# EAGLE design Interface board (EAGLE 9.3.0)
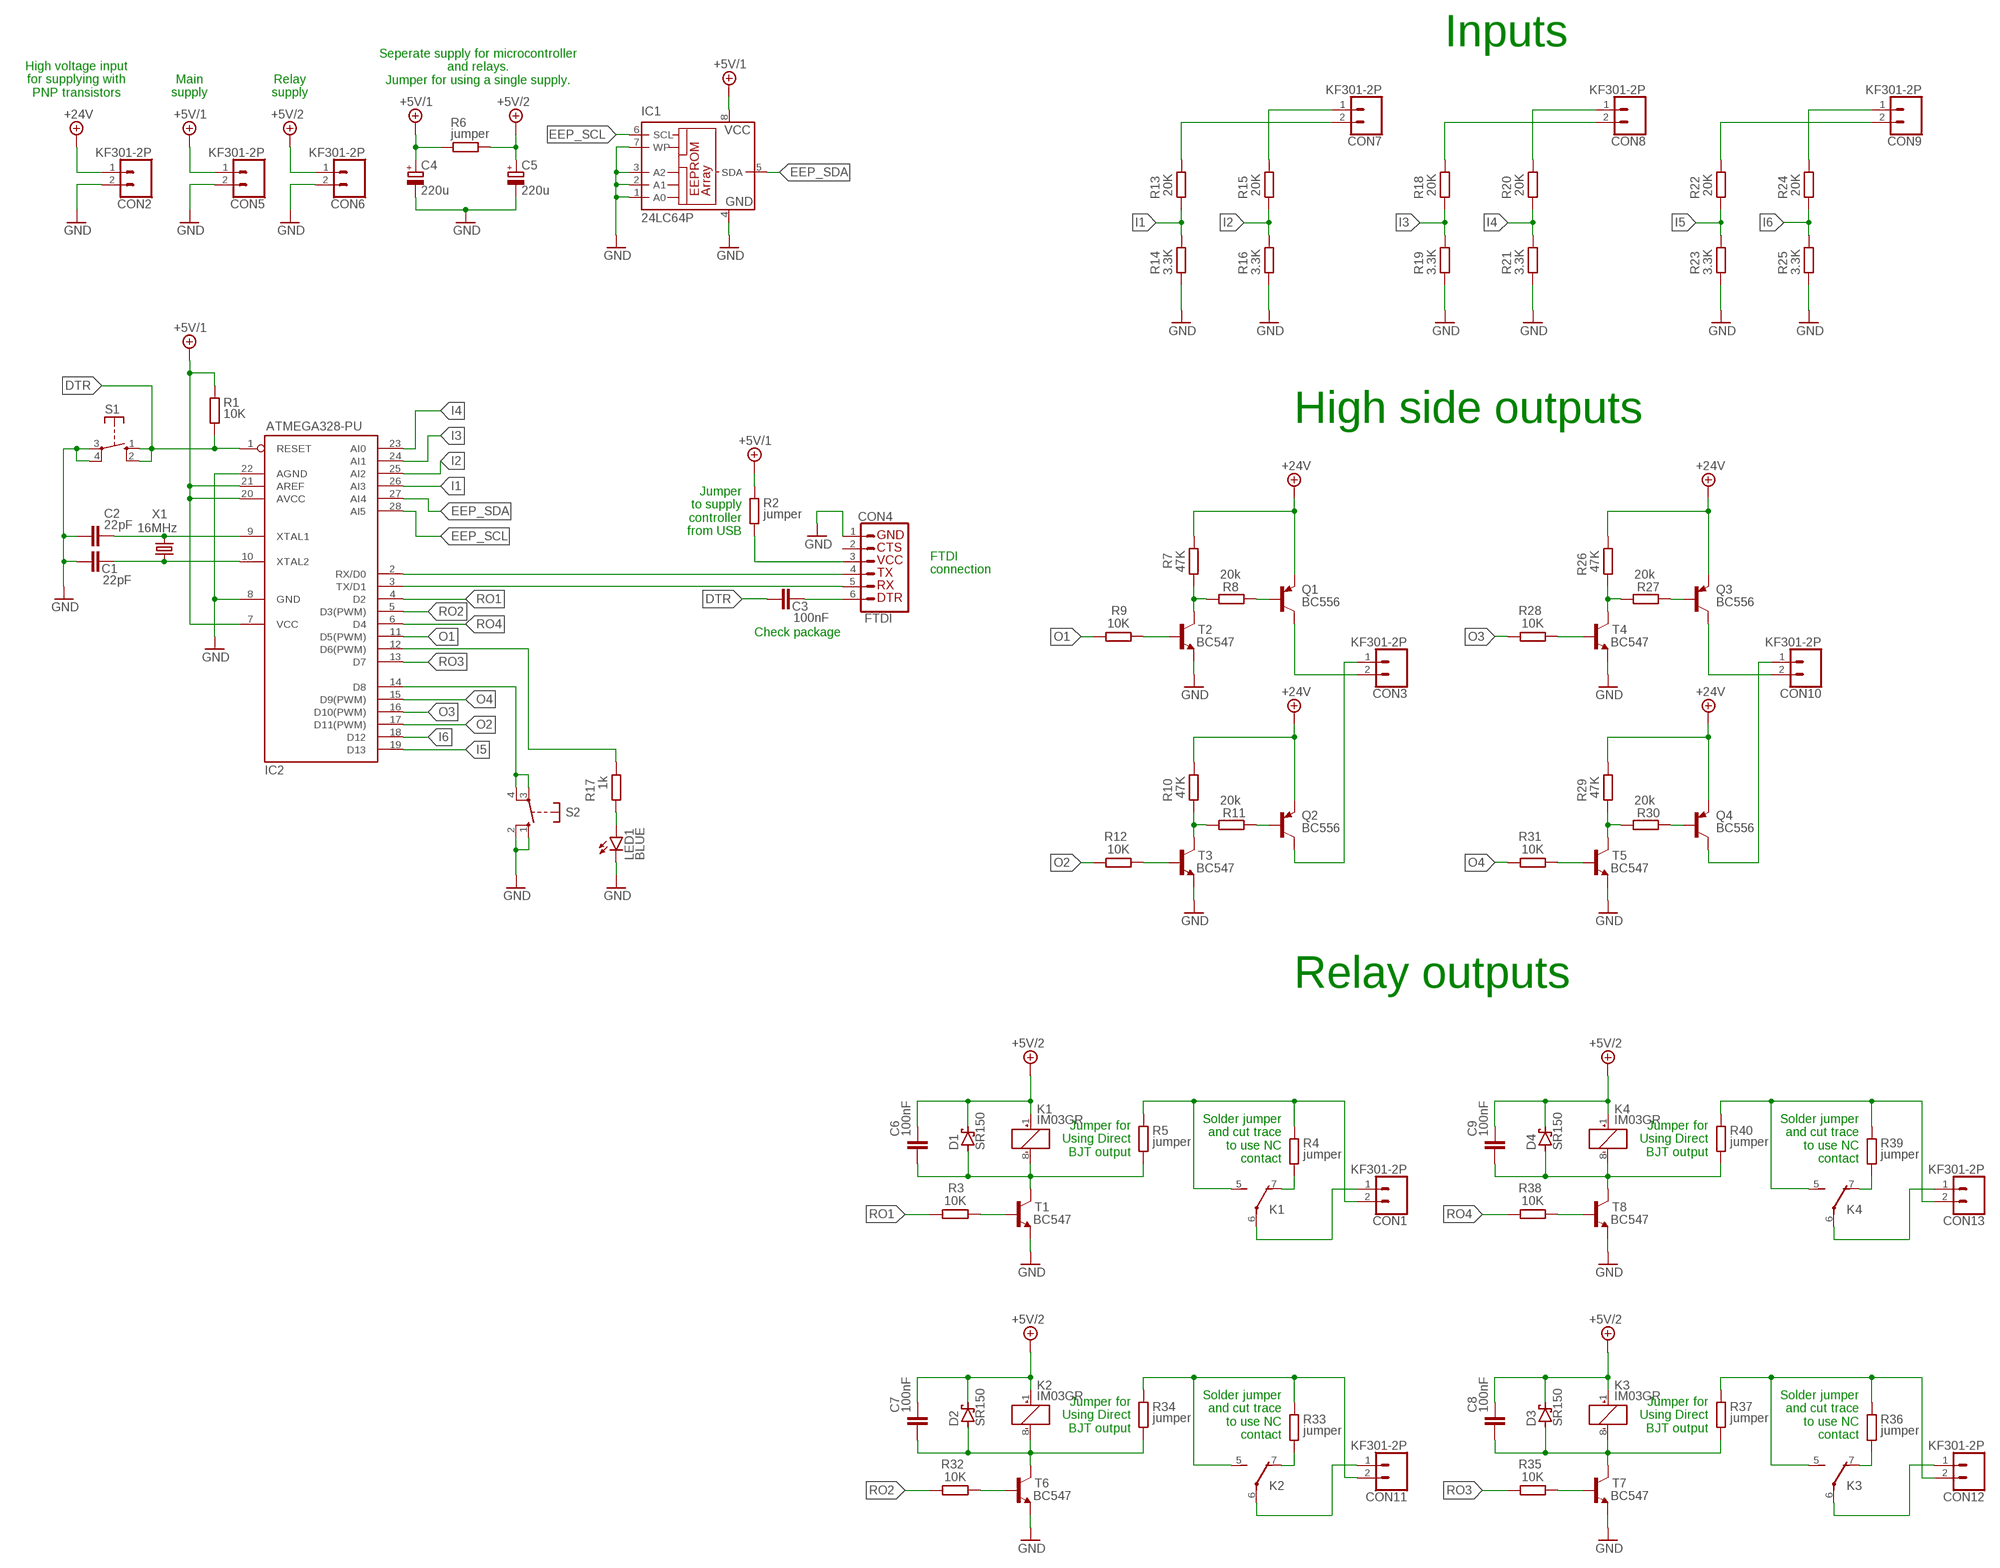
[diagram p0: schematic, sheet 1]

## Parts
C1  22pF  C-EU050-024X044  [C050-024X044]
C2  22pF  C-EU050-024X044  [C050-024X044]
C3  100nF  C-EU050-024X044  [C050-024X044]
C4  220u  CPOL-EUE5-10.5  [E5-10,5]
C5  220u  CPOL-EUE5-10.5  [E5-10,5]
C6  100nF  C-EU050-024X044  [C050-024X044]
C7  100nF  C-EU050-024X044  [C050-024X044]
C8  100nF  C-EU050-024X044  [C050-024X044]
C9  100nF  C-EU050-024X044  [C050-024X044]
CON1  KF301-2P  [KF301-2P]
CON2  KF301-2P  [KF301-2P]
CON3  KF301-2P  [KF301-2P]
CON4  FTDI  FTDI_CONN  [1X06_W_REC_GND]
CON5  KF301-2P  [KF301-2P]
CON6  KF301-2P  [KF301-2P]
CON7  KF301-2P  [KF301-2P]
CON8  KF301-2P  [KF301-2P]
CON9  KF301-2P  [KF301-2P]
CON10  KF301-2P  [KF301-2P]
CON11  KF301-2P  [KF301-2P]
CON12  KF301-2P  [KF301-2P]
CON13  KF301-2P  [KF301-2P]
D1  SR150  1N5817-B  [DO41-7.6]
D2  SR150  1N5817-B  [DO41-7.6]
D3  SR150  1N5817-B  [DO41-7.6]
D4  SR150  1N5817-B  [DO41-7.6]
IC1  24LC64P  [DIL8]
IC2  ATMEGA328-PU  328-PU_ARDUINO_F  [DIL28-3]
K1  IM03GR  [IM03GR]
K2  IM03GR  [IM03GR]
K3  IM03GR  [IM03GR]
K4  IM03GR  [IM03GR]
LED1  BLUE  LED5MM  [LED5MM]
Q1  BC556  [TO92-EBC]
Q2  BC556  [TO92-EBC]
Q3  BC556  [TO92-EBC]
Q4  BC556  [TO92-EBC]
R1  10K  R-EU_0204/7  [0204/7]
R2  jumper  R-EU_R0805  [R0805]
R3  10K  R-EU_0204/7  [0204/7]
R4  jumper  R-EU_R0805  [R0805]
R5  jumper  R-EU_R0805  [R0805]
R6  jumper  R-EU_R0805  [R0805]
R7  47K  R-EU_0204/7  [0204/7]
R8  20k  R-EU_0204/7  [0204/7]
R9  10K  R-EU_0204/7  [0204/7]
R10  47K  R-EU_0204/7  [0204/7]
R11  20k  R-EU_0204/7  [0204/7]
R12  10K  R-EU_0204/7  [0204/7]
R13  20K  R-EU_0204/7  [0204/7]
R14  3.3K  R-EU_0204/7  [0204/7]
R15  20K  R-EU_0204/7  [0204/7]
R16  3.3K  R-EU_0204/7  [0204/7]
R17  1k  R-EU_0204/7  [0204/7]
R18  20K  R-EU_0204/7  [0204/7]
R19  3.3K  R-EU_0204/7  [0204/7]
R20  20K  R-EU_0204/7  [0204/7]
R21  3.3K  R-EU_0204/7  [0204/7]
R22  20K  R-EU_0204/7  [0204/7]
R23  3.3K  R-EU_0204/7  [0204/7]
R24  20K  R-EU_0204/7  [0204/7]
R25  3.3K  R-EU_0204/7  [0204/7]
R26  47K  R-EU_0204/7  [0204/7]
R27  20k  R-EU_0204/7  [0204/7]
R28  10K  R-EU_0204/7  [0204/7]
R29  47K  R-EU_0204/7  [0204/7]
R30  20k  R-EU_0204/7  [0204/7]
R31  10K  R-EU_0204/7  [0204/7]
R32  10K  R-EU_0204/7  [0204/7]
R33  jumper  R-EU_R0805  [R0805]
R34  jumper  R-EU_R0805  [R0805]
R35  10K  R-EU_0204/7  [0204/7]
R36  jumper  R-EU_R0805  [R0805]
R37  jumper  R-EU_R0805  [R0805]
R38  10K  R-EU_0204/7  [0204/7]
R39  jumper  R-EU_R0805  [R0805]
R40  jumper  R-EU_R0805  [R0805]
S1  RACON12  [RACON12]
S2  RACON12  [RACON12]
T1  BC547  [TO92]
T2  BC547  [TO92]
T3  BC547  [TO92]
T4  BC547  [TO92]
T5  BC547  [TO92]
T6  BC547  [TO92]
T7  BC547  [TO92]
T8  BC547  [TO92]
X1  16MHz  CRYSTALS-NOGND-HC49  [HC49]

## Nets
+5V/1: C4.+ CON5.1 IC1.8(VCC) IC2.7(VCC) IC2.20(AVCC) IC2.21(AREF) R1.1 R2.1 R6.1
+5V/2: C5.+ C6.1 C7.1 C8.1 C9.1 CON6.1 D1.C D2.C D3.C D4.C K1.1(K:+) K2.1(K:+) K3.1(K:+) K4.1(K:+) R6.2
+24V: CON2.1 Q1.E Q2.E Q3.E Q4.E R7.2 R10.2 R26.2 R29.2
DTR: C3.2 IC2.1(RESET) R1.2 S1.1(S) S1.2(S)
EEP_SCL: IC1.6(SCL) IC2.28(AI5)
EEP_SDA: IC1.5(SDA) IC2.27(AI4)
GND: C1.2 C2.2 C4.- C5.- CON2.2 CON4.1 CON5.2 CON6.2 IC1.1(A0) IC1.2(A1) IC1.3(A2) IC1.4(GND) IC1.7(WP) IC2.8(GND) IC2.22(AGND) LED1.K(C) R14.1 R16.1 R19.1 R21.1 R23.1 R25.1 S1.3(P) S1.4(P) S2.1(S) S2.2(S) T1.1(E) T2.1(E) T3.1(E) T4.1(E) T5.1(E) T6.1(E) T7.1(E) T8.1(E)
I1: IC2.26(AI3) R13.1 R14.2
I2: IC2.25(AI2) R15.1 R16.2
I3: IC2.24(AI1) R18.1 R19.2
I4: IC2.23(AI0) R20.1 R21.2
I5: IC2.19(D13) R22.1 R23.2
I6: IC2.18(D12) R24.1 R25.2
N$1: C1.1 IC2.10(XTAL2) X1.2
N$2: C2.1 IC2.9(XTAL1) X1.1
N$3: IC2.12(D6(PWM)) R17.2
N$4: CON4.4 IC2.2(RX/D0)
N$5: CON4.5 IC2.3(TX/D1)
N$6: C3.1 CON4.6
N$7: IC2.14(D8) S2.3(P) S2.4(P)
N$8: CON4.3 R2.2
N$9: R3.2 T1.2(B)
N$10: R9.2 T2.2(B)
N$11: CON1.1 K1.6(-2:P)
N$12: K1.7(-2:O) R4.2
N$13: CON1.2 K1.5(-2:S) R4.1 R5.1
N$14: R38.2 T8.2(B)
N$15: R7.1 R8.2 T2.3(C)
N$16: Q1.B R8.1
N$17: C6.2 D1.A K1.8(K:-) R5.2 T1.3(C)
N$18: R10.1 R11.2 T3.3(C)
N$19: Q2.B R11.1
N$20: R12.2 T3.2(B)
N$21: CON3.2 Q1.C
N$22: CON3.1 Q2.C
N$23: R32.2 T6.2(B)
N$24: CON11.1 K2.6(-2:P)
N$25: CON13.1 K4.6(-2:P)
N$26: CON7.2 R13.2
N$27: CON13.2 K4.5(-2:S) R39.1 R40.1
N$28: CON7.1 R15.2
N$29: LED1.A R17.1
N$30: CON9.2 R22.2
N$31: CON8.2 R18.2
N$32: CON9.1 R24.2
N$33: CON8.1 R20.2
N$34: R26.1 R27.2 T4.3(C)
N$35: Q3.B R27.1
N$36: K4.7(-2:O) R39.2
N$37: CON11.2 K2.5(-2:S) R33.1 R34.1
N$38: K2.7(-2:O) R33.2
N$39: C9.2 D4.A K4.8(K:-) R40.2 T8.3(C)
N$42: C7.2 D2.A K2.8(K:-) R34.2 T6.3(C)
N$44: R28.2 T4.2(B)
N$45: R29.1 R30.2 T5.3(C)
N$46: Q4.B R30.1
N$47: R31.2 T5.2(B)
N$48: CON10.2 Q3.C
N$49: CON10.1 Q4.C
N$50: R35.2 T7.2(B)
N$51: CON12.1 K3.6(-2:P)
N$52: CON12.2 K3.5(-2:S) R36.1 R37.1
N$53: K3.7(-2:O) R36.2
N$55: C8.2 D3.A K3.8(K:-) R37.2 T7.3(C)
O1: IC2.11(D5(PWM)) R9.1
O2: IC2.17(D11(PWM)) R12.1
O3: IC2.16(D10(PWM)) R28.1
O4: IC2.15(D9(PWM)) R31.1
RO1: IC2.4(D2) R3.1
RO2: IC2.5(D3(PWM)) R32.1
RO3: IC2.13(D7) R35.1
RO4: IC2.6(D4) R38.1
Unconnected: CON4.2 K1.2(-1:O) K1.3(-1:P) K1.4(-1:S) K2.2(-1:O) K2.3(-1:P) K2.4(-1:S) K3.2(-1:O) K3.3(-1:P) K3.4(-1:S) K4.2(-1:O) K4.3(-1:P) K4.4(-1:S)

## Notes on the sheet
- Inputs
- Seperate supply for microcontroller
  and relays.
  Jumper for using a single supply.
- High voltage input
  for supplying with
  PNP transistors
- Main
  supply
- Relay
  supply
- High side outputs
- Jumper
  to supply
  controller
  from USB
- FTDI
  connection
- Check package
- Relay outputs
- Jumper for
  Using Direct
  BJT output
- Solder jumper
  and cut trace
  to use NC
  contact
- Jumper for
  Using Direct
  BJT output
- Solder jumper
  and cut trace
  to use NC
  contact
- Jumper for
  Using Direct
  BJT output
- Solder jumper
  and cut trace
  to use NC
  contact
- Jumper for
  Using Direct
  BJT output
- Solder jumper
  and cut trace
  to use NC
  contact

## Library data of the parts
C1-C3 C6-C9 = rcl:C-EU: CAPACITOR, European symbol; SPICEPREFIX: C
C4 C5 = rcl:CPOL-EU: POLARIZED CAPACITOR, European symbol; SPICEPREFIX: C
CON1-CON3 CON5-CON13 = ib_library:KF301-2P: 2 PIN CONNECTOR FROM E-BAY
CON4 = ib_library:FTDI_CONN
D1-D4 = diode:1N581*: 1.0A SCHOTTKY BARRIER RECTIFIER Source: http://www.diodes.com/datasheets/ds23001.pdf
IC1 = microchip:24*: Serial EEPROM I2C; MF: MICROCHIP; MPN: 24LC64-I/P; OC_FARNELL: 9758054; OC_NEWARK: 62K0584
IC2 = ib_library:328-PU_ARDUINO_F
K1-K4 = ib_library:IM03GR: TE IM Relay 2 POLES - 2 A
LED1 = led:LED: LED OSRAM: - CHIPLED LG R971, LG N971, LY N971, LG Q971, LY Q971, LO R971, LY R971 LH N974, LH R974 LS Q976, LO Q976, LY Q976 LO Q996 - Hyper CHIPLED LW Q18S LB Q993, LB Q99A, LB R99A - SideLED LS A670, LO A670, LY A670, LG A670, LP A670 LB A673, LV A673, LT A673, LW A673 LH A674 LY A675 LS A676, LA A676, LO A676, LY A676, LW A676 LS A679, LY A679, LG A679 - Hyper Micro SIDELED® LS Y876, LA Y876, LO Y876, LY Y876 LT Y87S - SmartLED LW L88C, LW L88S LB L89C, LB L89S, LG L890 LS L89K, LO L89K, LY L89K LS L896, LA L896, LO L896, LY L896 - TOPLED LS T670, LO T670, LY T670, LG T670, LP T670 LSG T670, LSP T670, LSY T670, LOP T670, LYG T670 LG T671, LOG T671, LSG T671 LB T673, LV T673, LT T673, LW T673 LH T674 LS T676, LA T676, LO T676, LY T676, LB T676, LH T676, LSB T676, LW T676 LB T67C, LV T67C, LT T67C, LS T67K, LO T67K, LY T67K, LW E67C LS E67B, LA E67B, LO E67B, LY E67B, LB E67C, LV E67C, LT E67C LW T67C LS T679, LY T679, LG T679 LS T770, LO T770, LY T770, LG T770, LP T770 LB T773, LV T773, LT T773, LW T773 LH T774 LS E675, LA E675, LY E675, LS T675 LS T776, LA T776, LO T776, LY T776, LB T776 LHGB T686 LT T68C, LB T68C - Hyper Mini TOPLED® LB M676 - Mini TOPLED Santana® LG M470 LS M47K, LO M47K, LY M47K Source: http://www.osram.convergy.de LUXEON: - LUMILED® LXK2-PW12-R00, LXK2-PW12-S00, LXK2-PW14-U00, LXK2-PW14-V00 LXK2-PM12-R00, LXK2-PM12-S00, LXK2-PM14-U00 LXK2-PE12-Q00, LXK2-PE12-R00, LXK2-PE12-S00, LXK2-PE14-T00, LXK2-PE14-U00 LXK2-PB12-K00, LXK2-PB12-L00, LXK2-PB12-M00, LXK2-PB14-N00, LXK2-PB14-P00, LXK2-PB14-Q00 LXK2-PR12-L00, LXK2-PR12-M00, LXK2-PR14-Q00, LXK2-PR14-R00 LXK2-PD12-Q00, LXK2-PD12-R00, LXK2-PD12-S00 LXK2-PH12-R00, LXK2-PH12-S00 LXK2-PL12-P00, LXK2-PL12-Q00, LXK2-PL12-R00 Source: www.luxeon.com KINGBRIGHT: KA-3528ASYC Source: www.kingbright.com
Q1-Q4 = transistor-pnp:BC556*: PNP Transistror
R1-R40 = rcl:R-EU_: RESISTOR, European symbol; SPICEPREFIX: R
S1 S2 = switch-misc:RACON12: ITT SWITCH
T1-T8 = transistor:BC547: NPN TRANSISTOR
X1 = IQD-Frequency-Products:CRYSTALS-NOGND: CRYSTALS CAN NOT GROUNDED

## Board
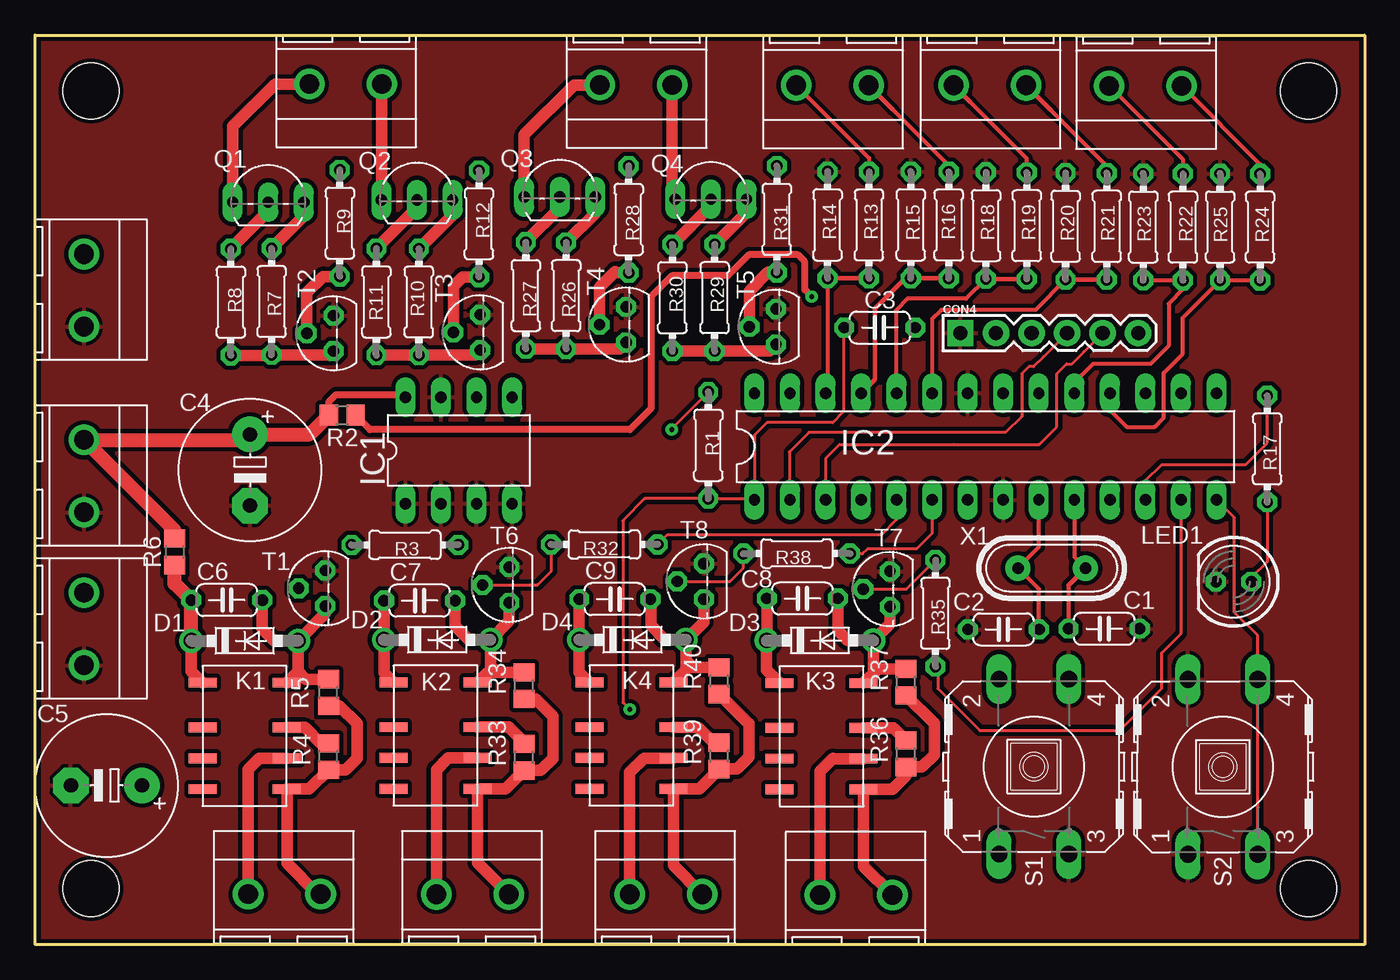
[diagram p1: board, top side]
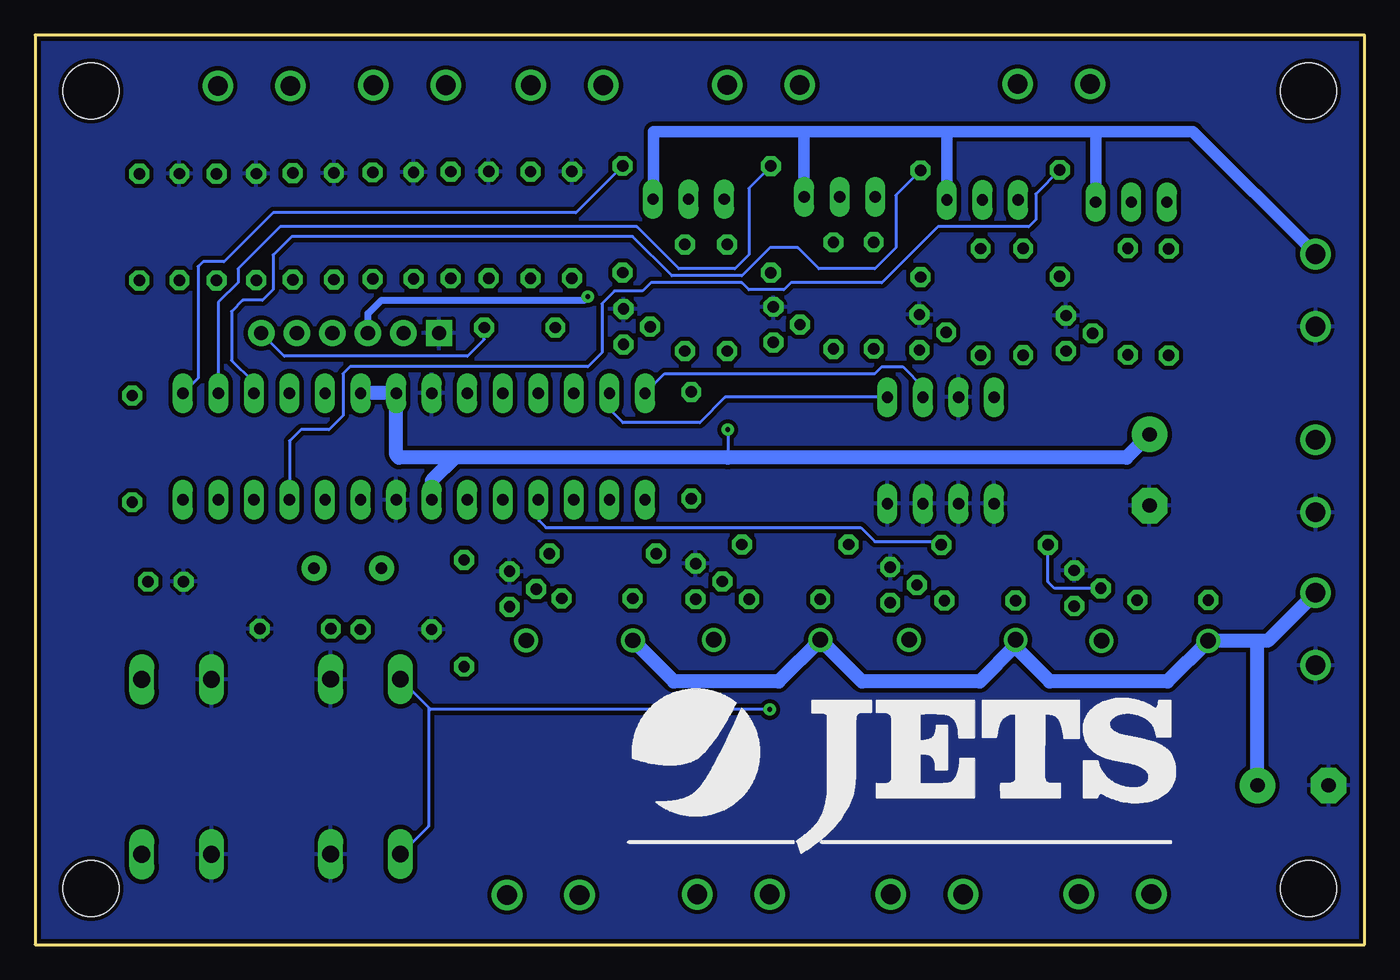
[diagram p2: board, bottom side, seen from below]

Size 95 x 65 mm. Coordinates in mm from the lower left corner, seen from the top.
Outline: 0,0 0,65 95,65 95,0 0,0
Copper layers (1*16): Top 0.035mm / dielectric 1.5mm / Bottom 0.035mm
Design rules "SparkFun *": minimum track width 5mil, minimum drill 0.3mm, track to track 8mil, track to pad 8mil, pad to pad 8mil, via to via 8mil, smd to smd 8mil, copper to edge 8mil, drill to drill 8mil, minimum pad ring 12mil, minimum via ring 10mil, stop-mask expansion 4mil, vias tented up to drill 20mil, thermal gap 10mil
Holes 4 mm at 4,4 4,61 91,61 91,4

### Footprints (pad centres in the part's own frame; a part is rotated, then mirrored left to right if it is on the bottom)
C050-024X044 = drill 0.813 octagon: 1 -2.54,0; 2 2.54,0
E5-10,5 = drill 1.016 pad 2.54: + -2.54,0 | drill 1.016 pad 2.54 octagon: - 2.54,0
KF301-2P = drill 1.4 pad 2.184: 1 2.46,3.5; 2 7.64,3.5
1X06_W_REC_GND = drill 1.016 pad 1.88 square: 1 0,0 | drill 1.016 pad 1.88: 2 2.54,0; 3 5.08,0; 4 7.62,0; 5 10.16,0; 6 12.7,0
DO41-7.6 = drill 1.1 pad 1.7: A 3.81,0; C -3.81,0
DIL8 = drill 0.813 long: 1 -3.81,-3.81; 2 -1.27,-3.81; 3 1.27,-3.81; 4 3.81,-3.81; 5 3.81,3.81; 6 1.27,3.81; 7 -1.27,3.81; 8 -3.81,3.81
DIL28-3 = drill 0.813 long: 1 -16.51,-3.81; 2 -13.97,-3.81; 3 -11.43,-3.81; 4 -8.89,-3.81; 5 -6.35,-3.81; 6 -3.81,-3.81; 7 -1.27,-3.81; 8 1.27,-3.81; 9 3.81,-3.81; 10 6.35,-3.81; 11 8.89,-3.81; 12 11.43,-3.81; 13 13.97,-3.81; 14 16.51,-3.81; 15 16.51,3.81; 16 13.97,3.81; 17 11.43,3.81; 18 8.89,3.81; 19 6.35,3.81; 20 3.81,3.81; 21 1.27,3.81; 22 -1.27,3.81; 23 -3.81,3.81; 24 -6.35,3.81; 25 -8.89,3.81; 26 -11.43,3.81; 27 -13.97,3.81; 28 -16.51,3.81
IM03GR = smd 0.7 x 2: 1 1.2,0; 2 4.4,0; 3 6.6,0; 4 8.8,0; 5 8.8,6; 6 6.6,6; 7 4.4,6; 8 1.2,6
LED5MM = drill 0.813 octagon: A -1.27,0; K 1.27,0
TO92-EBC = drill 0.813 long: B 0,-1.27; C -2.54,-1.27; E 2.54,-1.27
0204/7 = drill 0.813 octagon: 1 -3.81,0; 2 3.81,0
R0805 = smd 1.3 x 1.5: 1 -0.95,0; 2 0.95,0
RACON12 = drill 1.194 long: 1 -6.248,2.489; 2 6.248,2.489; 3 -6.248,-2.489; 4 6.248,-2.489
TO92 = drill 0.813 octagon: 1 1.27,0; 2 0,1.905; 3 -1.27,0
HC49 = drill 0.813 pad 1.8: 1 -2.413,0; 2 2.413,0

### Placement (x,y rotation side)
C1  76.4,22.57 0 top
C2  69.2,22.52 180 top
C3  60.36,44.09 180 top
C4  15.36,33.91 270 top
C5  5.11,11.37 180 top
C6  13.7,24.62 0 top
C7  27.48,24.58 0 top
C8  54.83,24.73 0 top
C9  41.43,24.68 0 top
CON1  12.77,0.1 0 top
CON2  0,51.8 270 top
CON3  27.24,64.99 180 top
CON4  66.13,43.7 0 top
CON5  0,38.52 270 top
CON6  0,27.59 270 top
CON7  62.02,64.91 180 top
CON8  73.27,64.91 180 top
CON9  84.4,64.87 180 top
CON10  47.99,64.93 180 top
CON11  26.23,0.09 0 top
CON12  53.63,0.04 0 top
CON13  40.03,0.09 0 top
D1  14.98,21.71 0 top
D2  28.74,21.78 0 top
D3  56.09,21.73 0 top
D4  42.69,21.78 0 top
IC1  30.28,35.31 0 top
IC2  67.92,35.59 0 top
K1  11.98,19.91 270 top
K2  25.61,19.93 270 top
K3  53.21,19.88 270 top
K4  39.61,19.93 270 top
LED1  85.65,25.93 180 top
Q1  16.66,54.33 0 top
Q2  27.3,54.49 0 top
Q3  37.5,54.7 0 top
Q4  48.3,54.54 0 top
R1  48.11,35.68 270 top
R2  21.95,37.83 0 top
R3  26.43,28.56 180 top
R4  20.97,13.43 90 top
R5  20.97,18.01 90 top
R6  9.98,28.06 270 top
R7  16.91,45.95 90 top
R8  13.99,45.91 270 top
R9  21.78,51.55 270 top
R10  27.43,45.92 90 top
R11  24.39,45.93 270 top
R12  31.72,51.51 270 top
R13  59.59,51.42 90 top
R14  56.63,51.43 270 top
R15  65.29,51.42 90 top
R16  62.58,51.43 270 top
R17  88.05,35.42 90 top
R18  70.87,51.37 90 top
R19  67.95,51.38 270 top
R20  76.58,51.32 90 top
R21  73.64,51.33 270 top
R22  82.03,51.27 90 top
R23  79.19,51.28 270 top
R24  87.54,51.27 90 top
R25  84.68,51.28 270 top
R26  37.95,46.37 90 top
R27  35.07,46.38 270 top
R28  42.42,51.82 270 top
R29  48.56,46.22 90 top
R30  45.54,46.22 270 top
R31  53.01,51.83 270 top
R32  40.68,28.59 180 top
R33  34.94,13.38 90 top
R34  34.94,18.5 90 top
R35  64.34,23.67 90 top
R36  62.24,13.63 90 top
R37  62.24,18.75 90 top
R38  54.43,27.94 180 top
R39  48.89,13.48 90 top
R40  48.89,18.85 90 top
S1  71.38,12.71 90 top
S2  84.88,12.7 90 top
T1  20.74,25.46 90 top
T2  21.33,43.68 90 top
T3  31.8,43.75 90 top
T4  42.24,44.3 90 top
T5  52.95,44.15 90 top
T6  33.89,25.7 90 top
T7  61.09,25.4 90 top
T8  47.79,25.95 90 top
X1  72.65,26.9 0 top

### Tracks (layer width: path | path; a pad name or v marks a point on that pad's centre or on a via)
+5V/1  (via drill 0.35)
  Top 0.2: R1.1 45.5,36.88 v45.5,36.8
  Top 0.508: R2.1 21,38.8 21.5,39.3 26.29,39.3 IC1.8
  Top 1: R6.1 9.98,29.58 CON5.1 14.97,36.06 C4.+
  Top 1.016: C4.+ 19.62,36.45 R2.1
  Bottom 0.2: v45.5,36.8 45.5,34.8
  Bottom 1.016: C4.+ 17.01,34.8 45.5,34.8 65,34.8 | IC2.7 66.65,33.15 65,34.8 | 65,34.8 69,34.8 69.19,34.99 IC2.21 IC2.20
+5V/2
  Top 0.813: D1.C 11.17,19.52 K1.1 | K2.1 24.93,19.41 D2.C C7.1 | K4.1 38.88,19.46 D4.C C9.1 | C8.1 D3.C 52.28,19.61 K3.1
  Top 1: D1.C C6.1 9.98,25.8 R6.2
  Bottom 1: CON6.1 6.92,21.71 7.5,21.71 | 7.5,21.71 D1.C 14.08,18.8 22.5,18.8 25,21.3 25,21.71 D2.C 24.93,21.37 27.5,18.8 35.9,18.8 D4.C 41.86,18.8 49.35,18.8 D3.C | C5.+ 7.65,21.56 7.5,21.71
+24V
  Top 0.813: R7.2 19.2,52.05 Q1.E | R10.2 29.84,52.14 Q2.E | R26.2 40.04,52.27 Q3.E | R29.2 50.84,52.31 Q4.E
  Bottom 0.813: 18.95,58.1 29.95,58.1 | Q1.E 19.2,57.85 18.95,58.1 | Q2.E 29.84,57.99 29.95,58.1 | Q4.E 50.8,53.31 50.8,58.1 39.95,58.1 | 29.95,58.1 39.95,58.1 | Q3.E 40.04,58.01 39.95,58.1 | CON2.1 12.26,58.1 18.95,58.1
DTR  (via drill 0.35)
  Top 0.2: IC2.1 51.4,36.4 52.3,37.3 57,37.3 57.82,38.12 C3.2 | IC2.1 | IC2.1 51.32,31.87 R1.2 43.57,31.87 42,30.3 42,17.3 v42.5,16.8
  Bottom 0.2: v42.5,16.8 66.73,16.8 S1.2 66.89,16.96 66.89,8.46 S1.1
EEP_SCL
  Bottom 0.2: IC2.28 50.01,40.8 35,40.8 34.5,41.3 33,41.3 31.55,39.85 IC1.6
EEP_SDA
  Bottom 0.2: IC1.5 45.68,39.12 47.5,37.3 53,37.3 54,38.3 54,39.35 IC2.27
GND
  pour Top (isolate 0.305): 0,0 0,65 95,65 95,0
  pour Bottom (isolate 0.305): 0,0 0,65 95,65 95,0
I1
  Top 0.3: R14.2 56.63,39.54 IC2.26
  Top 0.305: R14.2 R13.1
I2
  Top 0.3: 62.18,47.62 R16.2
  Top 0.305: R16.2 R15.1 | IC2.25 60,40.37 60,45.44 62.18,47.62
I3
  Top 0.3: R19.2 66.53,46.15 62.35,46.15 61.5,45.3 61.5,39.47 IC2.24
  Top 0.305: R19.2 R18.1
I4
  Top 0.3: R21.2 71.47,45.35 64.75,45.35 64.1,44.7 IC2.23
  Top 0.305: R21.2 R20.1
I5
  Top 0.3: IC2.19 74.3,39.43 74.3,40.2 75.6,41.5 79.7,41.5 81,42.8 81,45.8 82.03,46.83 R22.1 | R23.2 R22.1
  Top 0.305: R22.1
I6
  Top 0.3: R24.1 R25.2 83.01,45.8 83,45.8 82,44.8 82,42.2 80.65,40.85 80.65,37.65 80,37 78,37 76.81,38.19 IC2.18
N$1
  Top 0.3: IC2.10 74.27,27.69 X1.2 | 73.83,25.68 73.83,22.6 C1.1
  Top 0.305: X1.2 73.83,25.68
N$2
  Top 0.3: IC2.9 71.73,28.39 X1.1 71.74,25.4 C2.1
N$3
  Top 0.2: IC2.12 79.35,33.15 80.5,34.3 86.5,34.3 88.05,35.85 R17.2
N$4
  Top 0.2: CON4.4 72.05,42 | IC2.2 53.9,31.83 53.9,35.2 55.3,36.6 64.3,36.6
  Top 0.203: 72.05,42 71.35,41.3 71,41.3 70.5,40.8 70.5,37.75 69.35,36.6 64.3,36.6
N$5
  Top 0.2: 74.94,42.35 CON4.5 | 65.65,35.75 57.49,35.75 56.49,34.75 IC2.3
  Top 0.203: 65.65,35.75 71.75,35.75 73,37 73,40.8 73.7,41.5 74.09,41.5 74.94,42.35
N$6
  Bottom 0.2: CON4.6 77.18,42.05 64.1,42.05 62.9,43.25 C3.1
N$7
  Top 0.2: S2.3 S2.4 87.37,22.08 85.7,23.75 85.7,30.51 IC2.14
N$8  (via drill 0.35)
  Top 0.508: v55.5,46.3 55,46.8 55,48.8 54.5,49.3 51,49.3 49.5,47.8 45.5,47.8 44,46.3 44,38.3 42.5,36.8 23.93,36.8 R2.2
  Bottom 0.508: CON4.3 71.21,45.09 70.25,46.05 55.75,46.05 v55.5,46.3
N$9
  Bottom 0.2: T1.2 22.16,25.46 22.62,25.92 R3.2
N$10
  Top 0.813: T2.2 19.43,46.58 20.59,47.74 R9.2
N$11
  Top 0.813: CON1.1 15.23,12.53 16.01,13.31 K1.6
N$12
  Top 0.813: R4.2 20.42,14.38 19.29,15.51 K1.7
N$13
  Top 0.813: CON1.2 20.2,3.6 18,5.8 18,11.09 K1.5 19.6,11.11 R4.1 22.18,12.48 23,13.3 23,15.8 21.74,17.06 R5.1
N$14
  Top 0.2: T8.2 49.65,25.95 50.62,26.92 R38.2
N$15
  Top 0.813: R8.2 16.87,42.1 R7.1 21.06,42.14 T2.3
N$16
  Top 0.813: R8.1 16.66,52.39 Q1.B
N$17
  Top 0.813: C6.2 16.24,22.56 17.09,21.71 D1.A | D1.A 20.74,23.66 T1.3 | D1.A 18.79,19.52 | 18.79,19.52 K1.8 | 18.79,19.52 19.35,18.96 R5.2
N$18
  Top 0.813: R11.2 R10.1 31.43,42.11 T3.3
N$19
  Top 0.813: R11.1 27.3,52.65 Q2.B
N$20
  Top 0.813: T3.2 29.89,47.05 30.55,47.7 R12.2
N$21
  Top 0.813: CON3.2 17.15,61.5 14.12,58.47 Q1.C
N$22
  Top 0.813: CON3.1 24.78,53.24 Q2.C
N$23
  Top 0.2: T6.2 35.9,25.7 36.9,26.7 36.9,28.56 R32.2
N$24
  Top 0.813: CON11.1 28.69,12.49 29.53,13.33 K2.6
N$25
  Top 0.813: CON13.1 42.49,12.29 43.5,13.3 45.58,13.3 K4.6
N$26
  Top 0.3: CON7.2 59.59,56.2 R13.2
N$27
  Top 0.813: CON13.2 45.61,5.65 K4.5 47.49,11.13 R39.1 48.91,12.55 50.15,12.55 51,13.4 51,15.8 50.99,15.8 R40.1
N$28
  Top 0.3: 61.3,59.67 65.3,55.67 R15.2
  Top 0.305: CON7.1 61.3,59.67 | R15.2
N$29
  Top 0.2: R17.1 88.05,27.35 86.92,26.22 LED1.A
N$30
  Top 0.3: CON9.2 82,56.13 82,55.11 R22.2
N$31
  Top 0.3: 66.85,60.19 70.85,56.19 70.85,55.2
  Top 0.305: CON8.2 66.85,60.19 | 70.85,55.2 R18.2
N$32
  Top 0.3: R24.2 87.55,55.78 87.53,55.78 CON9.1
  Top 0.305: R24.2
N$33
  Top 0.3: R20.2 76.58,55.64 72.6,59.62
  Top 0.305: CON8.1 72.6,59.62
N$34
  Top 0.813: R27.2 R26.1 41.77,42.56 T4.3
N$35
  Top 0.813: R27.1 35.07,50.22 37.5,52.65 Q3.B
N$36
  Top 0.813: R39.2 48.47,14.43 47.37,15.53 K4.7
N$37
  Top 0.813: CON11.2 31.61,5.85 K2.5 33.64,11.13 R33.1 36.13,12.43 37,13.3 37,16.3 35.75,17.55 R34.1
N$38
  Top 0.813: R33.2 34.94,14.46 33.85,15.55 31.63,15.55 K2.7
N$39
  Top 0.813: K4.8 46.5,19.62 46.5,20.3 | 46.5,20.3 D4.A | R40.2 47,19.8 46.5,20.3 | C9.2 44,24.65 44,22.8 45.02,21.78 D4.A | D4.A 47.79,23.07 T8.3
N$42
  Top 0.813: K2.8 32.33,19.45 33,19.45 | 33,19.45 R34.2 | D2.A 32.55,19.9 33,19.45 | C7.2 30.02,22.78 31.02,21.78 D2.A | D2.A 33.89,23.12 T6.3
N$44
  Top 0.813: T4.2 40.34,46.98 41.45,48.1 41.54,48.01 R28.2
N$45
  Top 0.813: R30.2 R29.1 52.48,42.41 T5.3
N$46
  Top 0.813: R30.1 48.3,52.79 Q4.B
N$47
  Top 0.813: T5.2 51.05,46.7 52.39,48.04 52.99,48.04 R31.2
N$48
  Top 0.813: Q3.C 34.96,57.86 38.5,61.4 40.32,61.4 CON10.2
N$49
  Top 0.813: CON10.1 45.53,53.5 Q4.C
N$50
  Top 0.2: T7.2 62.26,25.4 R35.2
N$51
  Top 0.813: CON12.1 56.09,12.39 57,13.3 57.02,13.28 K3.6
N$52
  Top 0.813: CON12.2 59.21,5.6 K3.5 61.28,11.08 62.24,12.04 R36.1 63.38,12.68 64.25,13.55 64.25,15.79 R37.1
N$53
  Top 0.813: R36.2 61.34,15.48 K3.7
N$55
  Top 0.813: K3.8 59.9,19.37 | 59.9,19.37 60.23,19.7 R37.2 | D3.A 59.9,19.37 | C8.2 57.37,22.43 58.07,21.73 D3.A | D3.A 61.09,22.92 T7.3
O1
  Bottom 0.2: R9.1 23.5,53.64 23.5,51.8 24,51.3 30.5,51.3 34.5,47.3 41,47.3 41.5,46.8 44,46.8 44.5,47.3 51,47.3 51.6,46.7 53.6,46.7 54.5,45.8 54.5,42.3 55.5,41.3 72.5,41.3 73,40.8 73,37.8 74,36.8 76,36.8 76.81,35.99 IC2.11
O2
  Bottom 0.2: R12.1 33.5,53.54 33.5,49.8 35,48.3 39,48.3 40.5,49.8 42.5,49.8 44.5,47.8 49.5,47.8 52.3,50.6 76.65,50.6 77.95,49.3 78,49.3 78,46.8 78.75,46.05 80.15,46.05 80.95,45.25 80.95,41.75 79.5,40.3 79.5,39.55 IC2.17
O3
  Bottom 0.2: R28.1 44,54.05 44,49.3 45,48.3 49,48.3 52,51.3 77.5,51.3 80.5,48.3 80.5,47.3 81.9,45.9 IC2.16
O4
  Bottom 0.2: R31.1 56.35,52.3 78,52.3 81.5,48.8 83,48.8 83.35,48.45 83.35,40.48 IC2.15
RO1
  Bottom 0.2: IC2.4 59,31.75 59,30.3 58.5,29.8 36,29.8 35,28.8 30.48,28.8 R3.1
RO2
  Top 0.2: R32.1 45.2,29.3 60.5,29.3 61.57,30.37 IC2.5
RO3
  Top 0.2: R35.1 64.5,19.7 64.5,18.3 67.5,15.3 77.5,15.3 80.5,18.3 80.5,20.85 81.9,22.25 IC2.13
RO4
  Top 0.2: R38.1 59.14,27.94 59.5,28.3 63,28.3 64.11,29.41 IC2.6